# EAGLE design PICKIT4-adaptorUPDI-ONLY (EAGLE 7.7.0)
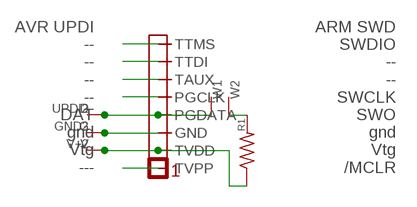
[diagram p0: schematic, sheet 1]

## Parts
D  WIRE-R10  [VIA10]
G  WIRE-R10  [VIA10]
GND2  WIRE-R12  [VIA12]
R1  R-US_0204/7  [0204/7]
U$1  PICKIT4PINHDR  [PINHEAD1X8]
UPDI2  WIRE-R12  [VIA12]
V  WIRE-R10  [VIA10]
V+2  WIRE-R12  [VIA12]
W1  WIRE-R10  [VIA10]
W2  WIRE-R10  [VIA10]

## Nets
GND: G.P$1 GND2.P$1 U$1.P$3(GND)
N$2: R1.1 U$1.P$2(TVDD) V+2.P$1 V.P$1
N$3: U$1.P$8(TTMS)
N$4: D.P$1 U$1.P$4(PGDATA) UPDI2.P$1 W1.P$1
N$5: U$1.P$7(TTDI)
N$6: U$1.P$6(TAUX)
N$7: U$1.P$5(PGCLK)
N$8: U$1.P$1(TVPP)
N$9: R1.2 W2.P$1

## Library data of the parts
D G GND2 UPDI2 V V+2 W1 W2 = mylib4:WIRE: Pad for a wire offboard
R1 = my-rcl:R-US_: RESISTOR, American symbol
U$1 = mylib4:PICKIT4: PICKIT 4 Programming connector Handles PICx, ARM SWD, AVR ISP, UPDI, PDI, TPI, an JTAG/EJTAG

## Net classes
0 default: width 0.4 mm, drill 0.6 mm, clearance 0.152 mm
1 power: width 0.8 mm, drill 0.7 mm, clearance 0.152 mm
2 clock: width 0.25 mm, drill 0.6 mm, clearance 0.152 mm

## Board
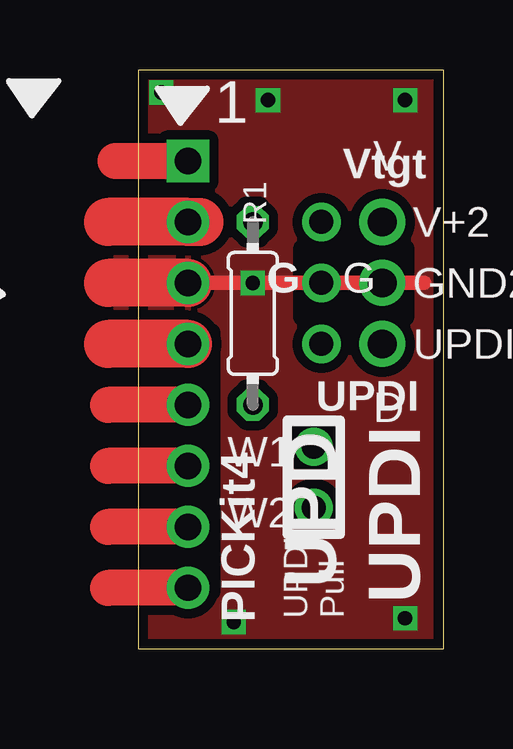
[diagram p1: board, top side]
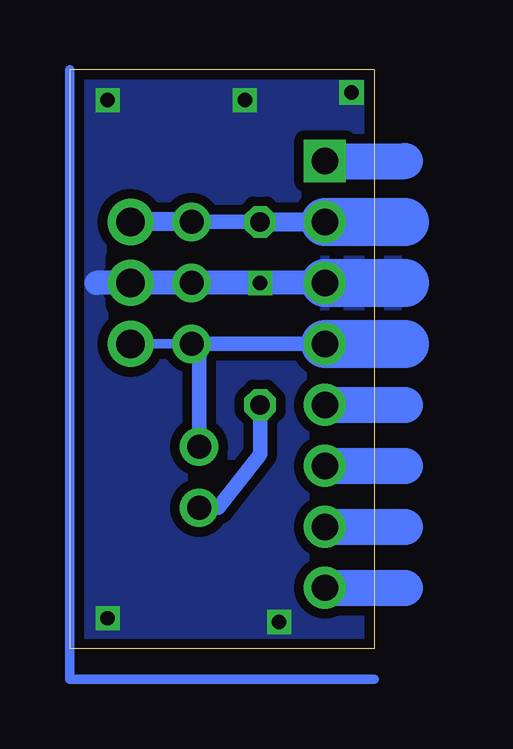
[diagram p2: board, bottom side, seen from below]

Size 12.7 x 24.13 mm. Coordinates in mm from the lower left corner, seen from the top.
Outline: 0,0 12.7,0 12.7,24.13 0,24.13 0,0
Copper layers (1*16): Top 0.035mm / dielectric 1.5mm / Bottom 0.035mm
Design rules "default *": minimum track width 10mil, minimum drill 24mil, track to track 6mil, track to pad 6mil, pad to pad 8mil, via to via 8mil, smd to smd 8mil, copper to edge 16mil, drill to drill 8mil, minimum pad ring 10mil, minimum via ring 8mil, stop-mask expansion 4mil, vias tented up to drill 0.65mm, thermal gap 10mil
tRestrict: area 6.8,13.8 to 11.1,16.7; 1 lines
bRestrict: area 3.2,14.3 to 10.8,16.4

### Footprints (pad centres in the part's own frame; a part is rotated, then mirrored left to right if it is on the bottom)
VIA10 = drill 1: P$1 0,0
VIA12 = drill 1.2: P$1 0,0
0204/7 = drill 0.813 octagon: 1 -3.81,0; 2 3.81,0
PINHEAD1X8 = drill 1.1 square: P$1 0,8.89 | drill 1.1: P$2 0,6.35; P$3 0,3.81; P$4 0,1.27; P$5 0,-1.27; P$6 0,-3.81; P$7 0,-6.35; P$8 0,-8.89

### Placement (x,y rotation side)
D  7.62,12.7 0 top
G  7.62,15.24 0 top
GND2  10.16,15.24 0 top
R1  4.76,13.97 270 top
U$1  2.06,11.43 0 top
UPDI2  10.16,12.7 0 top
V  7.62,17.78 0 top
V+2  10.16,17.78 0 top
W1  7.3,8.41 180 top
W2  7.3,5.87 180 top

### Tracks (layer width: path | path; a pad name or v marks a point on that pad's centre or on a via)
GND  (via drill 0.6)
  Top 0.6: U$1.P$3 v4.76,15.24 G.P$1 11.91,15.24
  Top 2: U$1.P$3 -1.27,15.24
  Bottom 1: U$1.P$3 v4.76,15.24 GND2.P$1 11.59,15.24
  Bottom 2: U$1.P$3 -1.27,15.24
  other vias: 0.95,23.18 11.11,22.86 11.11,1.27 3.97,1.11 5.4,22.86
  pour Top (isolate 0.4): -0.95,24.77 -0.95,-2.22 13.02,-2.22 13.02,24.77
  pour Bottom (isolate 0.4): -0.95,25.16 -0.95,-1.91 12.78,-1.98 12.78,25.32
N$1
  Bottom 0.4: 0,-1.27 12.7,-1.27 12.7,24.13
N$2
  Top 2: 2.54,17.78 U$1.P$2 -1.27,17.78
  Bottom 0.6: R1.1 V.P$1
  Bottom 0.8: V.P$1 V+2.P$1 | R1.1 U$1.P$2
  Bottom 2: U$1.P$2 -1.27,17.78
N$3
  Top 1.5: U$1.P$8 -1.27,2.54
  Bottom 1.5: U$1.P$8 -1.27,2.54
N$4
  Top 2: U$1.P$4 -1.27,12.7
  Bottom 0.4: D.P$1 UPDI2.P$1
  Bottom 0.6: U$1.P$4 D.P$1 7.3,12.38 W1.P$1
  Bottom 2: U$1.P$4 -1.27,12.7
N$5
  Top 1.5: U$1.P$7 -1.27,5.08
  Bottom 1.5: U$1.P$7 -1.27,5.08
N$6
  Top 1.5: U$1.P$6 -1.27,7.62
  Bottom 1.5: U$1.P$6 -1.27,7.62
N$7
  Top 1.5: U$1.P$5 -1.27,10.16
  Bottom 1.5: U$1.P$5 -1.27,10.16
N$8
  Top 1.5: U$1.P$1 -0.95,20.32
  Bottom 1.5: U$1.P$1 -1.27,20.32
N$9
  Bottom 0.6: R1.2 4.76,8.1 6.51,5.87 W2.P$1

### Text on the board
tPlace: UPDI
_tSilk: 1 | Vtgt | G | UPDI | UPDI / Pull | UPDI | PICKit4
_bplace: V | G | D | PICKit4 | UPDI